# Altium schematic sheet karmanDB_camera.SchDoc
size A
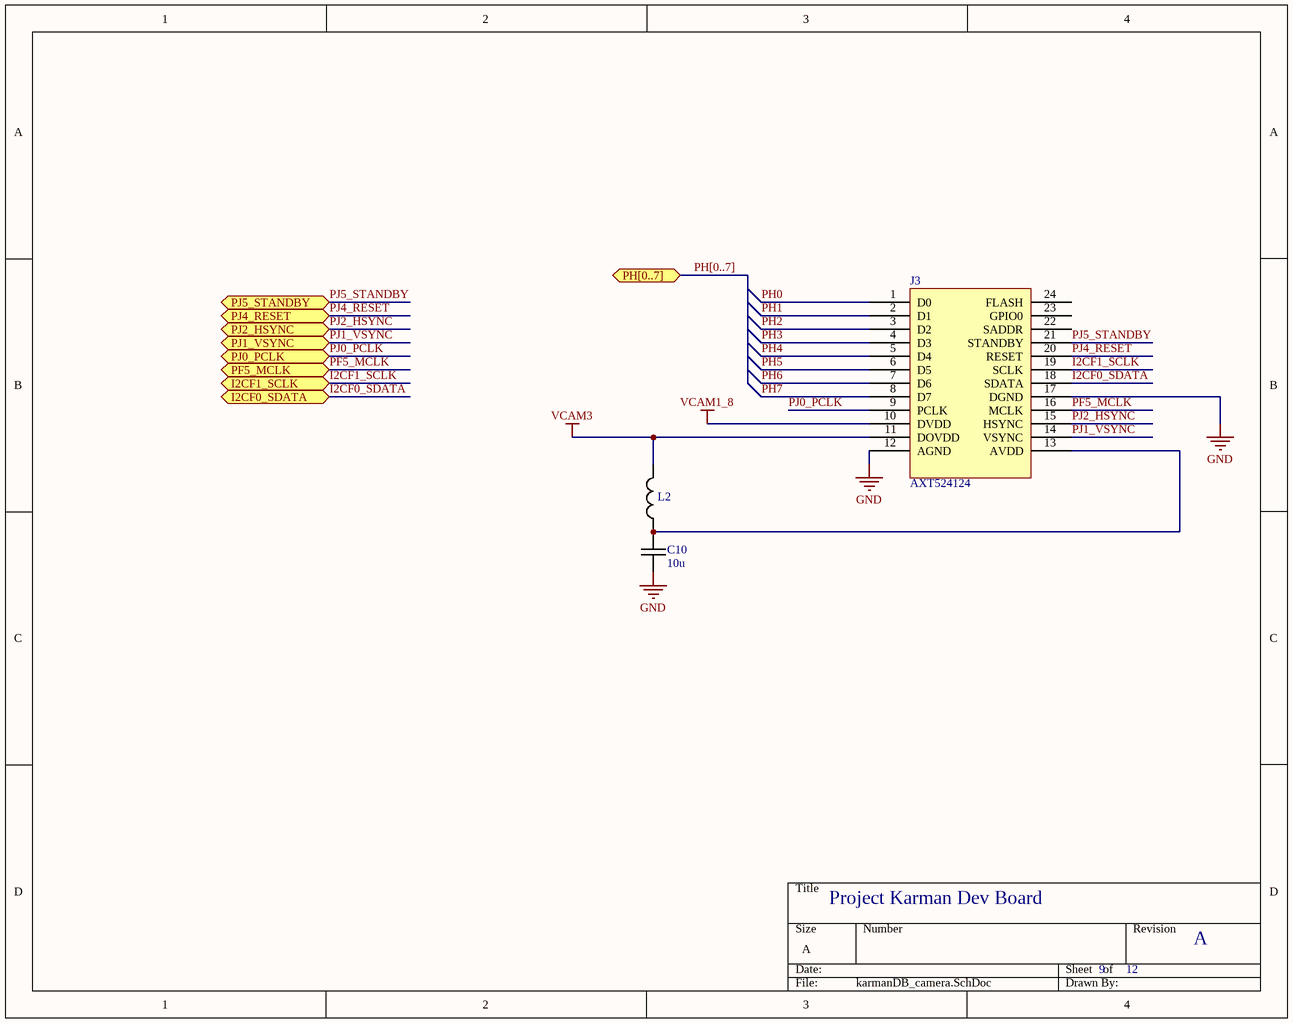
[diagram p0: karmanDB_camera.SchDoc]

## Parts
C10  10u  [MURATA_GRM_0603]
J3  AXT524124  [AXT524124]
L2  BLM15BB221SN1D  [BLM15]  (value not drawn)

## Ports
I2CF0_SDATA (bidir), I2CF1_SCLK (bidir), PF5_MCLK (bidir), PH[0..7], PJ0_PCLK (bidir), PJ1_VSYNC (bidir), PJ2_HSYNC (bidir), PJ4_RESET (bidir), PJ5_STANDBY (bidir)

## Nets
GND: C10.2 J3.12(AGND) J3.17(DGND)
VCAM1_8: J3.10(DVDD)
VCAM3: J3.11(DOVDD) L2.2
I2CF0_SDATA: J3.18(SDATA) ; port I2CF0_SDATA
I2CF1_SCLK: J3.19(SCLK) ; port I2CF1_SCLK
PF5_MCLK: J3.16(MCLK) ; port PF5_MCLK
PH0: J3.1(D0)
PH1: J3.2(D1)
PH2: J3.3(D2)
PH3: J3.4(D3)
PH4: J3.5(D4)
PH5: J3.6(D5)
PH6: J3.7(D6)
PH7: J3.8(D7)
PJ0_PCLK: J3.9(PCLK) ; port PJ0_PCLK
PJ1_VSYNC: J3.14(VSYNC) ; port PJ1_VSYNC
PJ2_HSYNC: J3.15(HSYNC) ; port PJ2_HSYNC
PJ4_RESET: J3.20(RESET) ; port PJ4_RESET
PJ5_STANDBY: J3.21(STANDBY) ; port PJ5_STANDBY
NetC10_1: C10.1 J3.13(AVDD) L2.1

Not connected (* = marked no-connect by the designer): J3 22(SADDR) 23(GPIO0) 24(FLASH)

## Buses and harness runs
bus PH[0..7] = port PH[0..7]

## Notes on the sheet
- Project Karman Dev Board
- 9
- 12
- A

## Library data of the parts
C10 = CAP_MURATA_GRM188R60J106: CAP CER 10UF 6.3V 20% X5R 0603; Manufacturer: Murata Electronics North America; Manufacturer Part Number: GRM188R60J106ME47J; Capacitance: 10µF; Supplier 1: Digi-Key; Supplier Part Number 1: 490-6405-1-ND; RoHS: RoHS Compliant; Category: Capacitors; Stock 1: 159118; Pricing: 1=0.19, 10=0.128, 50=0.0776, 100=0.0651, 250=0.05272, 500=0.0465, 1000=0.03953, 5000=0.03333 (USD); Packaging: Cut Tape (CT); Tolerance: ±20%; Voltage - Rated: 6.3V; Temperature Coefficient: X5R; Mounting Type: Surface Mount, MLCC; Operating Temperature: -55°C ~ 85°C; Applications: General Purpose; Ratings: -; Package / Case: 0603 (1608 Metric); Size / Dimension: 0.063" L x 0.031" W (1.60mm x 0.80mm); Height - Seated (Max): -; Thickness (Max): 0.035" (0.90mm); Lead Spacing: -; Features: -; Lead Style: -; ComponentLink1URL: http://www.murata.com/~/media/webrenewal/support/library/catalog/products/capacitor/mlcc/c02e.ashx; ComponentLink1Description: http://www.murata.com/~/media/webrenewal/support/library/catalog/products/capacitor/mlcc/c02e.ashx
J3 = AXT524124: CONN SOCKET F4S .4MM 24POS SMD; Manufacturer: Panasonic Electric Works; Connector Type: Socket, Outer Shroud Contacts; Number of Positions: 24; Pitch: 0.016" (0.40mm); Mated Stacking Heights: 1mm; Supplier 1: Digi-Key; Manufacturer Part Number: AXT524124; RoHS: RoHS Compliant; Category: Connectors, Interconnects; Stock 1: 1416; Pricing 1: 1=2.29, 10=1.901, 100=1.408, 250=1.2352, 500=1.1264 (USD); Packaging: Cut Tape (CT); Number of Rows: 2; Mounting Type: Surface Mount; Features: Solder Retention; Contact Finish: Gold; Contact Finish Thickness: -; Height Above Board: 0.038" (0.97mm); ComponentLink1URL: http://www3.panasonic.biz/ac/e_download/control/connector/base-fpc/catalog/con_eng_f4s.pdf; ComponentLink1Description: http://www3.panasonic.biz/ac/e_download/control/connector/base-fpc/catalog/con_eng_f4s.pdf; Supplier Part Number 1: 255-2411-1-ND
L2 = BLM15BB221SN1D: FERRITE CHIP 220 OHM 200MA 0402; Manufacturer: Murata Electronics North America; Impedance @ Frequency: 220 Ohm @ 100MHz; DC Resistance (DCR): 800 mOhm Max; Filter Type: Differential Mode - Single; Supplier 1: Digi-Key; Manufacturer Part Number: BLM15BB221SN1D; RoHS: RoHS Compliant; Category: Filters; Stock 1: 37626; Pricing 1: 1=0.1, 10=0.083, 50=0.0544, 100=0.047, 250=0.03712, 500=0.03136, 1000=0.0264, 5000=0.02351 (USD); Packaging: Cut Tape (CT); Current Rating: 200mA; Package / Case: 0402 (1005 Metric); Mounting Type: Surface Mount; Height (Max): 0.022" (0.55mm); Size / Dimension: 0.039" L x 0.020" W (1.00mm x 0.50mm); ComponentLink1URL: http://search.murata.co.jp/Ceramy/image/img/PDF/ENG/L0110S0100BLM15B.pdf; ComponentLink1Description: http://search.murata.co.jp/Ceramy/image/img/PDF/ENG/L0110S0100BLM15B.pdf; Supplier Part Number 1: 490-5190-1-ND